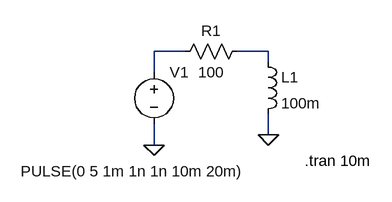
[diagram p0: schematic RL_circuit.asc]
RL_circuit.asc, the LTspice schematic file:
Version 4
SHEET 1 880 680
WIRE 160 96 112 96
WIRE 288 96 240 96
WIRE 288 112 288 96
WIRE 112 128 112 96
WIRE 288 224 288 192
WIRE 112 240 112 208
FLAG 288 224 0
FLAG 112 240 0
SYMBOL res 256 80 R90
WINDOW 0 0 56 VBottom 2
WINDOW 3 32 56 VTop 2
SYMATTR InstName R1
SYMATTR Value 100
SYMBOL ind 272 96 R0
SYMATTR InstName L1
SYMATTR Value 100m
SYMBOL voltage 112 112 R0
WINDOW 3 -205 168 Left 2
WINDOW 123 0 0 Left 0
WINDOW 39 0 0 Left 0
SYMATTR InstName V1
SYMATTR Value PULSE(0 5 1m 1n 1n 10m 20m)
TEXT 344 264 Left 2 !.tran 10m

The netlist it stands for:
* RL_circuit.asc
R1 N002 N001 100
L1 N002 0 100m
V1 N001 0 PULSE(0 5 1m 1n 1n 10m 20m)
.tran 10m
.backanno
.end